# EAGLE design ssslidar_v1.0_blade_PWR_bottom (EAGLE 7.6.0)
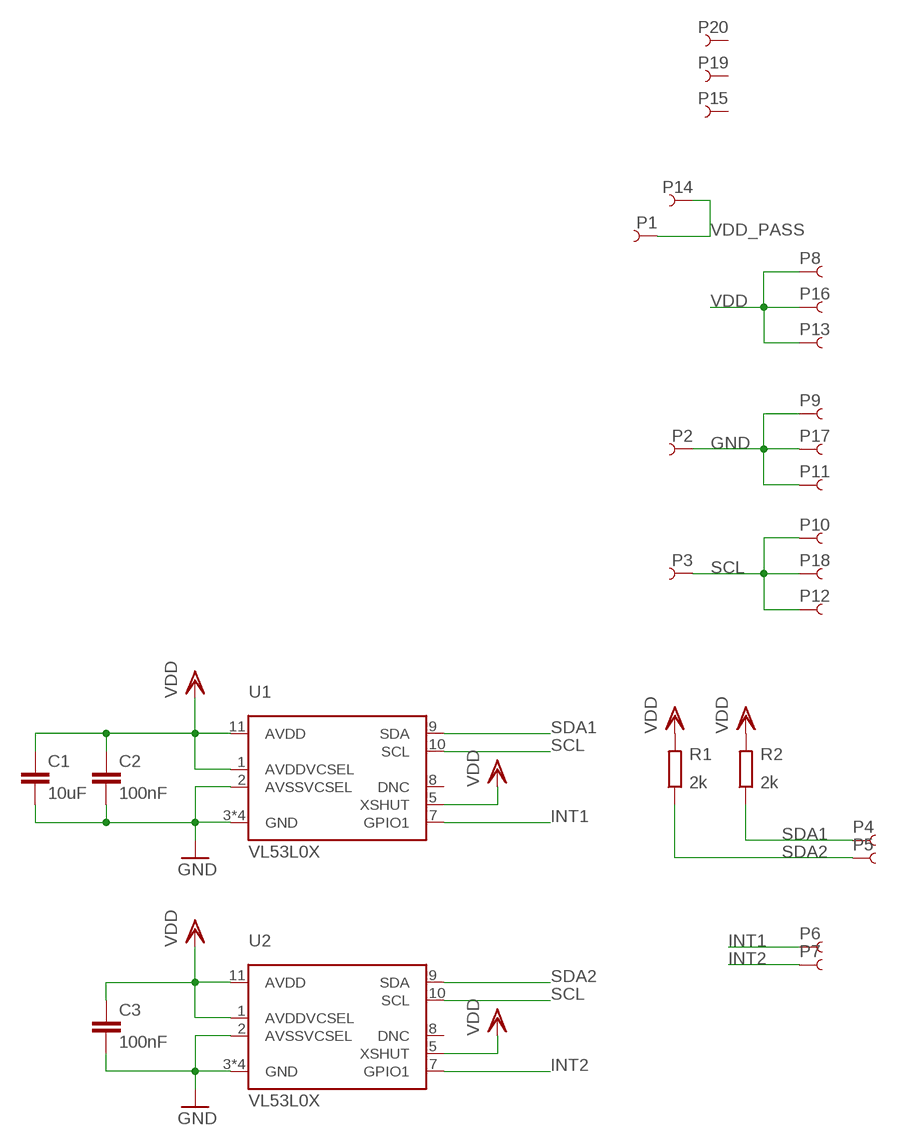
[diagram p0: schematic, sheet 1]

## Parts
C1  10uF  C0805  [0805_N]
C2  100nF  C0402  [0402_N]
C3  100nF  C0402  [0402_N]
P1  PIN_SMD_0.8X1_RECT  [PIN_SMD_0.8X1_RECT]
P2  PIN_SMD_1X2  [PIN_SMD_1X2]
P3  PIN_SMD_0.8X1_RECT  [PIN_SMD_0.8X1_RECT]
P4  PIN_SMD_0.8X1_RECT  [PIN_SMD_0.8X1_RECT]
P5  PIN_SMD_0.8X1_RECT  [PIN_SMD_0.8X1_RECT]
P6  PIN_SMD_0.8X1_RECT  [PIN_SMD_0.8X1_RECT]
P7  PIN_SMD_0.8X1_RECT  [PIN_SMD_0.8X1_RECT]
P8  PIN_SMD_0.8X1_RECT  [PIN_SMD_0.8X1_RECT]
P9  PIN_SMD_1X2  [PIN_SMD_1X2]
P10  PIN_SMD_1X2  [PIN_SMD_1X2]
P11  PIN_SMD_1X2  [PIN_SMD_1X2]
P12  PIN_SMD_1X2  [PIN_SMD_1X2]
P13  PIN_SMD_1X2  [PIN_SMD_1X2]
P14  PIN_SMD_0.8X1_RECT  [PIN_SMD_0.8X1_RECT]
P15  PIN_SMD_0.8X1_RECT  [PIN_SMD_0.8X1_RECT]
P16  PIN_SMD_1X2  [PIN_SMD_1X2]
P17  PIN_SMD_1X2  [PIN_SMD_1X2]
P18  PIN_SMD_0.8X1_RECT  [PIN_SMD_0.8X1_RECT]
P19  PIN_SMD_0.8X1_RECT  [PIN_SMD_0.8X1_RECT]
P20  PIN_SMD_0.8X1_RECT  [PIN_SMD_0.8X1_RECT]
R1  2k  R0402  [0402_N]
R2  2k  R0402  [0402_N]
U1  VL53L0X  [VL53L0X]
U2  VL53L0X  [VL53L0X]

## Nets
GND: C1.2 C2.2 C3.2 P2.P$1 P9.P$1 P11.P$1 P17.P$1 U1.2(AVSSVCSEL) U1.3(GND) U1.4(GND) U1.6(GND) U1.12(GND) U2.2(AVSSVCSEL) U2.3(GND) U2.4(GND) U2.6(GND) U2.12(GND)
INT1: P6.PIN U1.7(GPIO1)
INT2: P7.PIN U2.7(GPIO1)
SCL: P3.PIN P10.P$1 P12.P$1 P18.PIN U1.10(SCL) U2.10(SCL)
SDA1: P4.PIN R2.1 U1.9(SDA)
SDA2: P5.PIN R1.1 U2.9(SDA)
VDD: C1.1 C2.1 C3.1 P8.PIN P13.P$1 P16.P$1 R1.2 R2.2 U1.1(AVDDVCSEL) U1.5(XSHUT) U1.11(AVDD) U2.1(AVDDVCSEL) U2.5(XSHUT) U2.11(AVDD)
VDD_PASS: P1.PIN P14.PIN
Unconnected: P15.PIN P19.PIN P20.PIN U1.8(DNC) U2.8(DNC)

## Library data of the parts
C1-C3 = Xevelabs:C: Non-polarized Capacitor
P1-P20 = Xevelabs:PIN
R1 R2 = Xevelabs:R: Resistor
U1 U2 = VL53L0X:VL53L0X: VL53L0X distance sensor

## Board
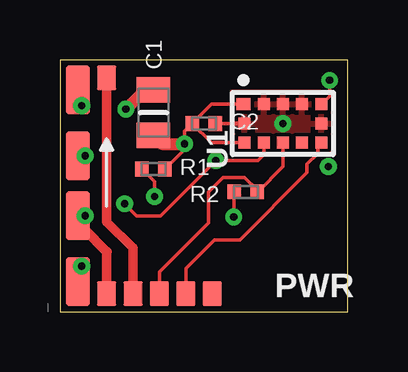
[diagram p1: board, top side]
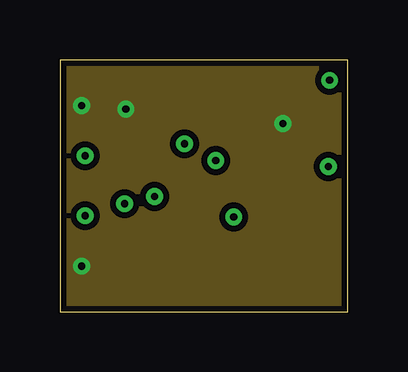
[diagram p2: board, inner layer Route2]
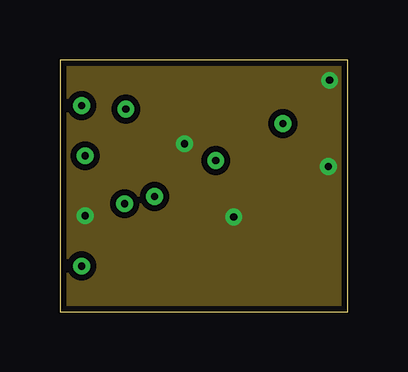
[diagram p3: board, inner layer Route3]
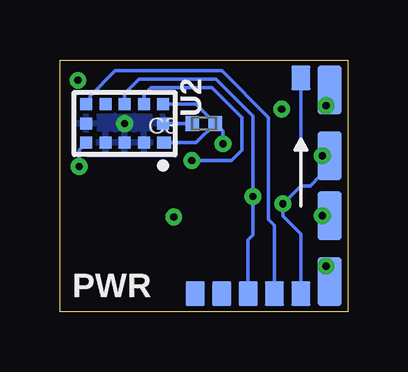
[diagram p4: board, bottom side, seen from below]

Size 12 x 10.5 mm. Coordinates in mm from the lower left corner, seen from the top.
Outline: 0,0 12,0 12,10.5 0,10.5 0,0
Copper layers (1*2*3*16): Top 0.035mm / dielectric 0.15mm / Route2 0.035mm / dielectric 1.1mm / Route3 0.035mm / dielectric 0.15mm / Bottom 0.035mm
Design rules "Xevelabs_6mil_4layers_eurocircuits": minimum track width 0.15mm, minimum drill 0.25mm, track to track 0.155mm, track to pad 0.155mm, pad to pad 0.155mm, via to via 0.155mm, smd to smd 0mil, copper to edge 0.25mm, drill to drill 0.25mm, minimum pad ring 0.15mm, minimum via ring 0.2mm, stop-mask expansion 0mil, vias tented up to drill 100mil, thermal gap 0.2mm

### Footprints (pad centres in the part's own frame; a part is rotated, then mirrored left to right if it is on the bottom)
0805_N = smd 1.05 x 1.4: 1 -0.95,0; 2 0.95,0
0402_N = smd 0.57 x 0.62: 1 -0.48,0; 2 0.48,0
PIN_SMD_0.8X1_RECT = smd 1 x 0.8: PIN 0,0
PIN_SMD_1X2 = smd 2 x 1: P$1 0,0
VL53L0X = smd 0.5 x 0.58: 1 0.8,1.64 | smd 0.5 x 0.5: 2 0.8,0.8; 3 0.8,0; 4 0.8,-0.8; 5 0.8,-1.6; 6 0,-1.6; 7 -0.8,-1.6; 8 -0.8,-0.8; 9 -0.8,0; 10 -0.8,0.8; 11 -0.8,1.6; 12 0,1.6

### Placement (x,y rotation side)
C1  3.9,8.3 90 top
C2  6,7.85 0 top
C3  6,7.85 180 bottom
P1  1.95,9.75 90 top
P2  0.75,9.25 270 bottom
P3  1.95,0.75 90 bottom
P4  4.15,0.75 90 top
P5  4.15,0.75 90 bottom
P6  5.25,0.75 90 top
P7  3.05,0.75 90 bottom
P8  1.95,0.75 90 top
P9  0.75,9.25 90 top
P10  0.75,6.5 90 bottom
P11  0.75,1.25 270 top
P12  0.75,6.5 90 top
P13  0.75,4 270 bottom
P14  3.05,0.75 90 top
P15  5.25,0.75 270 bottom
P16  0.75,4 270 top
P17  0.75,1.25 270 bottom
P18  1.95,9.75 90 bottom
P19  6.35,0.75 90 top
P20  6.35,0.75 90 bottom
R1  3.9,5.95 0 top
R2  7.75,5 180 top
U1  9.3,7.85 90 top
U2  9.3,7.85 270 bottom

### Tracks (layer width: path | path; a pad name or v marks a point on that pad's centre or on a via)
GND  (via drill 0.3)
  Top 0.15: P9.P$1 0.9,9.25 v0.9,8.6 | C3.2 U2.12 | 0.7,1.25 P11.P$1 0.75,1.9 v0.9,1.9
  Top 0.5: v2.75,8.45 3.55,9.25 C1.2
  Bottom 0.15: P9.P$1 0.9,9.25 v0.9,8.6 | 0.7,1.25 P11.P$1 | U2.12 C3.2
  Bottom 0.406: 0.9,1.25 P11.P$1 0.75,1.9 v0.9,1.9
  other vias: 9.3,7.85
  pour Route2 (isolate 0.254): 0,10.5 12,10.5 12,0 0,0
  pour Top: 11.45,9.2 7.15,9.2 7.15,6.5 11.45,6.5
  pour Bottom: 11.45,9.2 7.15,9.2 7.15,6.5 11.45,6.5
INT1
  Top 0.15: U1.7 10.75,6.9 10.75,6.6 10.3,6.15 10.3,5.8 7.5,3 6.45,3 5.25,1.8 P6.PIN
INT2
  Bottom 0.15: U2.7 10.75,8.8 10.75,9 9.7,10.05 5.25,10.05 3.3,8.1 3.3,3.85 3.05,3.6 P7.PIN
SCL  (via drill 0.3)
  Top 0.15: P12.P$1 v1.05,6.5 | U1.10 8.5,6.55 8.25,6.3 v6.5,6.3 4.2,4 3.2,4 v2.7,4.5
  Bottom 0.15: P12.P$1 v1.05,6.5 1.15,6.4 1.15,5.65 1.55,5.25 1.95,5.25 | U2.10 8.5,9.05 8.2,9.35 5.65,9.35 4.4,8.1 4.4,6.75 4.85,6.3 v6.5,6.3 | P18.PIN 1.95,5.25 | 1.95,5.25 v2.7,4.5 2.7,4 1.95,3.25 P3.PIN
SDA1
  Top 0.15: U1.9 9.3,6.05 8.25,5 R2.1 8.23,5.07 7.7,5.6 6.8,5.6 6.2,5 6.2,3.7 4.15,1.65 P4.PIN
SDA2  (via drill 0.3)
  Top 0.15: R1.1 3.95,5.42 v3.95,4.8
  Bottom 0.15: U2.9 9.3,9.1 8.7,9.7 5.5,9.7 3.95,8.15 v3.95,4.8 3.95,3.2 4.15,3 P5.PIN
VDD  (via drill 0.3)
  Top 0.15: v1.05,4 P13.P$1 | v11.25,9.65 11.25,9 U1.5 | U1.11 6.32,7.05 C3.1 | C3.1 5.2,7.53 v5.2,7 5.2,6.77 R1.2 | C3.1 6.32,8.65 U1.1 | v7.25,3.95 7.27,3.97 R2.2
  Top 0.4: P8.PIN 1.95,2.5
  Top 0.406: 1.95,2.5 1.05,3.4 v1.05,4
  Top 0.5: C1.1 4.25,7 v5.2,7
  Bottom 0.15: P13.P$1 v1.05,4 | U2.5 11.2,6.75 v11.2,6.05 | U2.11 6.32,8.65 C3.1 | U2.1 6.32,7.05 C3.1 | v5.2,7 5.2,7.53 C3.1
  pour Route3 (isolate 0.254): 0,10.5 12,10.5 12,0 0,0
VDD_PASS
  Top 0.4: P14.PIN 3.05,2.65 1.95,3.75 P1.PIN

### Text on the board
tPlace: PWR
bPlace: PWR